# Altium schematic sheet Sheet1.SchDoc
size A3
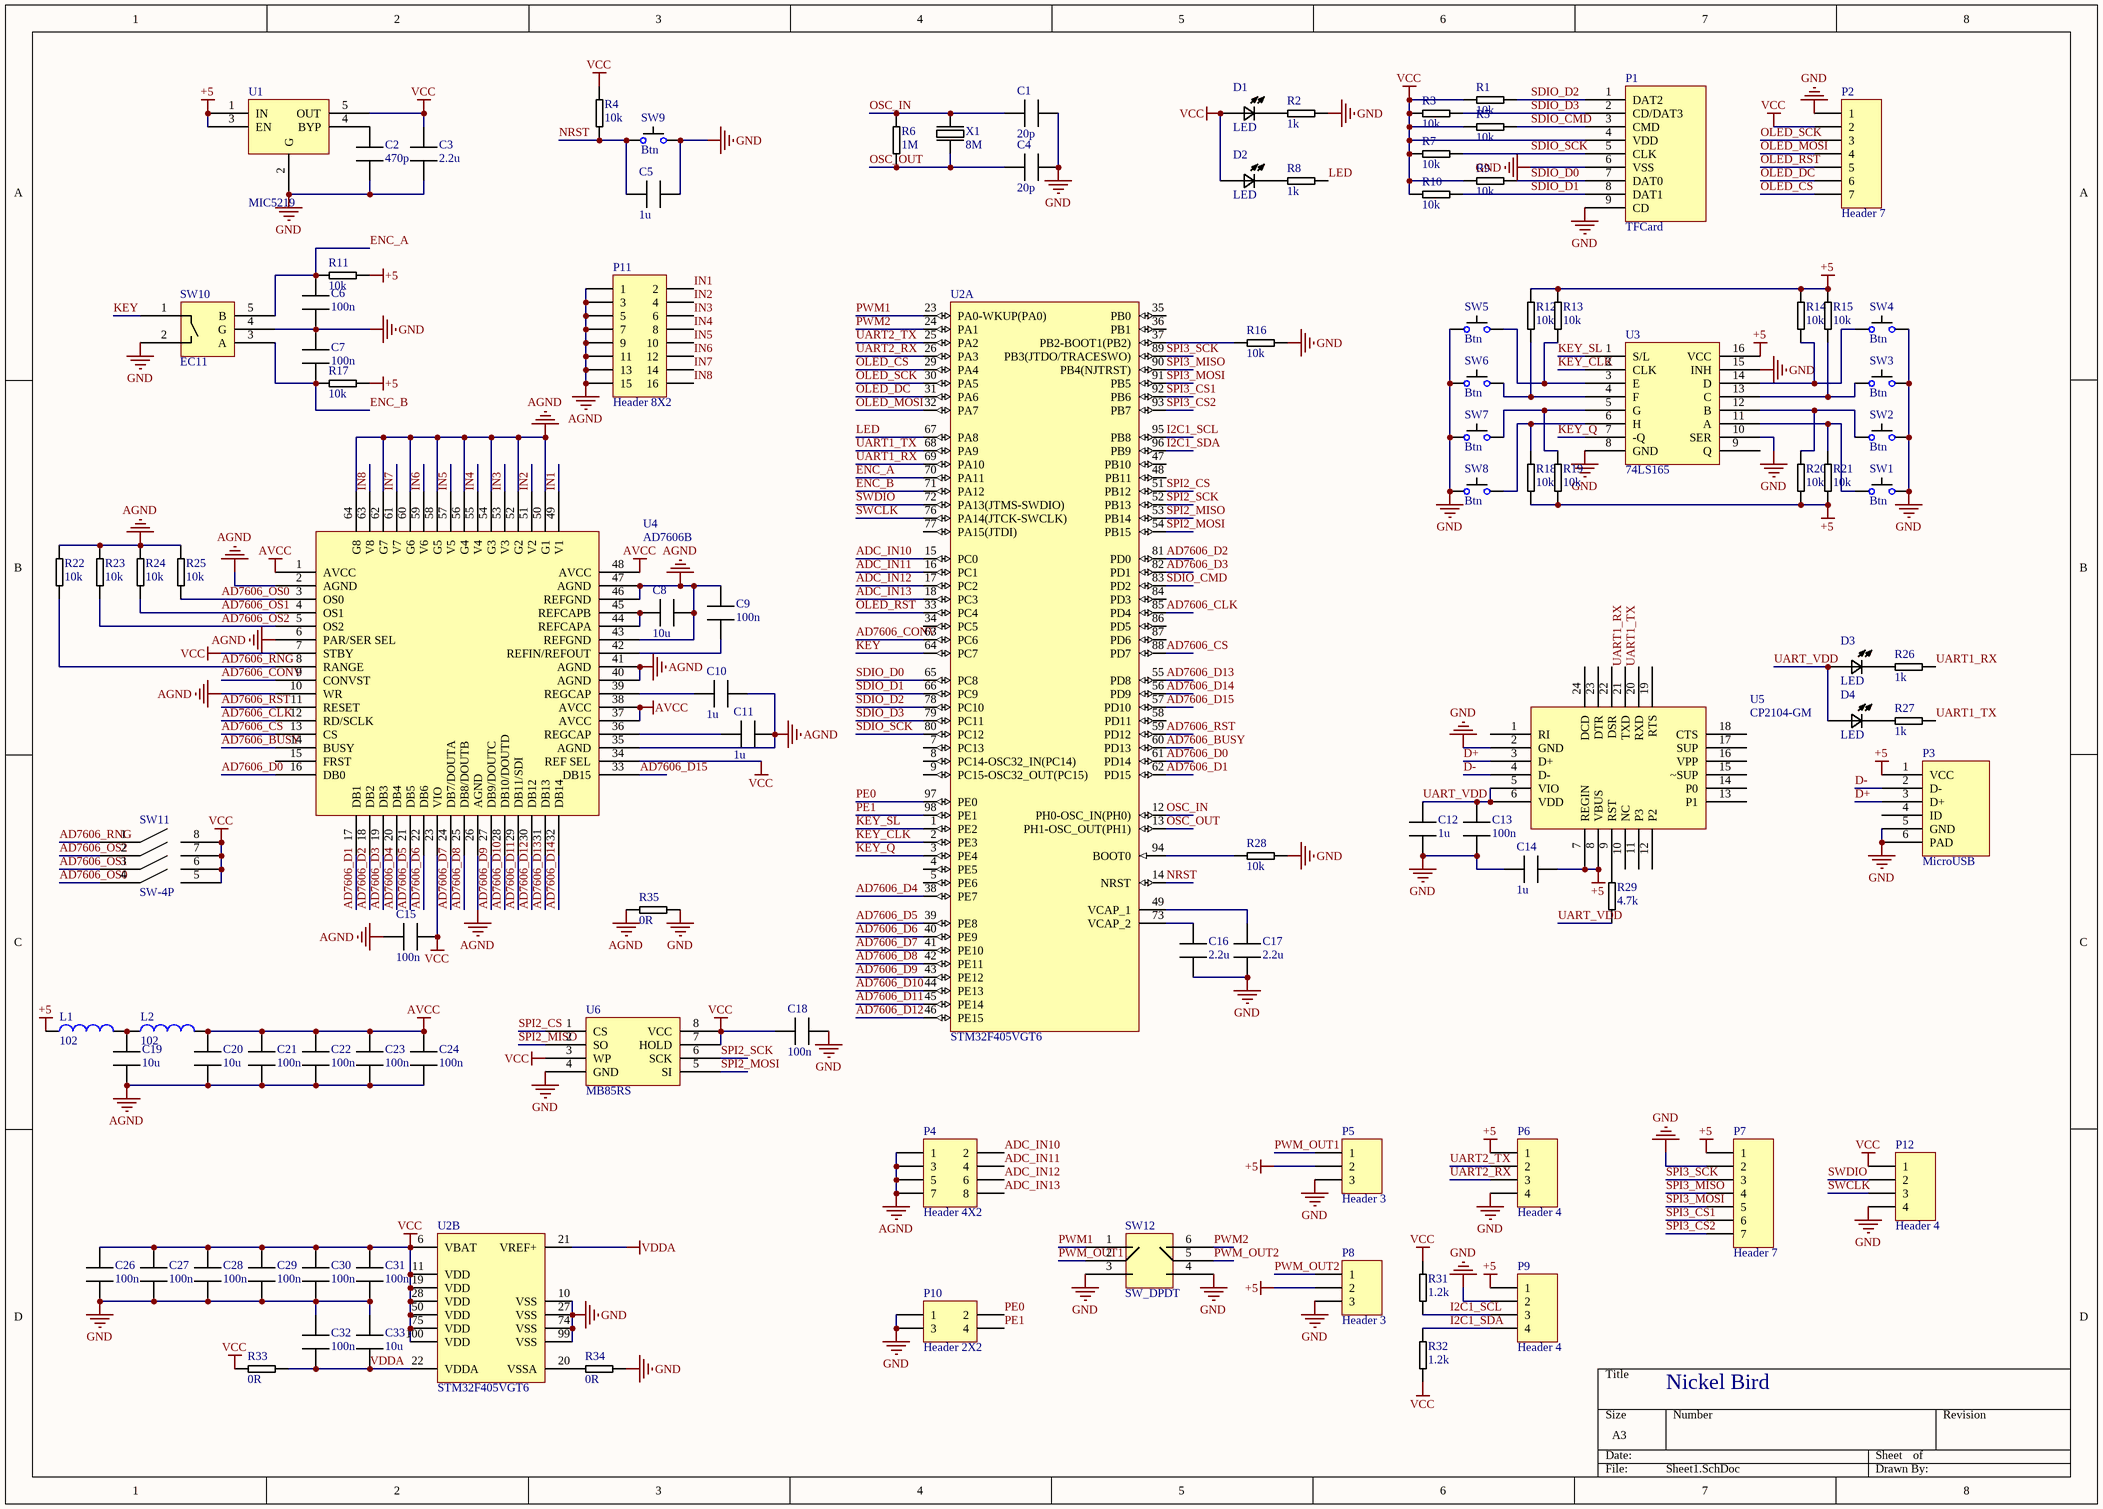
[diagram p0: Sheet1.SchDoc]

## Parts
C1  20p  [0603]
C2  470p  [0603]
C3  2.2u  [0603]
C4  20p  [0603]
C5  1u  [0603]
C6  100n  [0603]
C7  100n  [0603]
C8  10u  [0603]
C9  100n  [0603]
C10  1u  [0603]
C11  1u  [0603]
C12  1u  [0603]
C13  100n  [0603]
C14  1u  [0603]
C15  100n  [0603]
C16  2.2u  [0603]
C17  2.2u  [0603]
C18  100n  [0603]
C19  10u  [0603]
C20  10u  [0603]
C21  100n  [0603]
C22  100n  [0603]
C23  100n  [0603]
C24  100n  [0603]
C26  100n  [0603]
C27  100n  [0603]
C28  100n  [0603]
C29  100n  [0603]
C30  100n  [0603]
C31  100n  [0603]
C32  100n  [0603]
C33  10u  [0603]
D1  LED  [0603-1]
D2  LED  [0603-1]
D3  LED  [0603-1]
D4  LED  [0603-1]
L1  102  [0603]
L2  102  [0603]
P1  TFCard  [TF Card]
P2  Header 7  [HDR1X7]
P3  MicroUSB  [MicroUSB]
P4  Header 4X2  [HDR2X4]
P5  Header 3  [HDR1X3]
P6  Header 4  [HDR1X4]
P7  Header 7  [HDR1X7]
P8  Header 3  [HDR1X3]
P9  Header 4  [HDR1X4]
P10  Header 2X2  [HDR2X2]
P11  Header 8X2  [HDR2X8]
P12  Header 4  [HDR1X4]
R1  10k  [0603]
R2  1k  [0603]
R3  10k  [0603]
R4  10k  [0603]
R5  10k  [0603]
R6  1M  [0603]
R7  10k  [0603]
R8  1k  [0603]
R9  10k  [0603]
R10  10k  [0603]
R11  10k  [0603]
R12  10k  [0603]
R13  10k  [0603]
R14  10k  [0603]
R15  10k  [0603]
R16  10k  [0603]
R17  10k  [0603]
R18  10k  [0603]
R19  10k  [0603]
R20  10k  [0603]
R21  10k  [0603]
R22  10k  [0603]
R23  10k  [0603]
R24  10k  [0603]
R25  10k  [0603]
R26  1k  [0603]
R27  1k  [0603]
R28  10k  [0603]
R29  4.7k  [0603]
R31  1.2k  [0603]
R32  1.2k  [0603]
R33  0R  [0603]
R34  0R  [0603]
R35  0R  [0603]
SW1  Btn  [BTN3*3]
SW2  Btn  [BTN3*3]
SW3  Btn  [BTN3*3]
SW4  Btn  [BTN3*3]
SW5  Btn  [BTN3*3]
SW6  Btn  [BTN3*3]
SW7  Btn  [BTN3*3]
SW8  Btn  [BTN3*3]
SW9  Btn  [BTN3*3]
SW10  EC11  [EC11]
SW11  SW-4P  [SW-1.27-4P]
SW12  SW_DPDT  [DPDT7mm]
U1  MIC5219  [SOT23-5]
U2  STM32F405VGT6  [STM-LQFP100_N]  (parts A,B of 2)
U3  74LS165  [SOP16]
U4  AD7606B  [LQFP-64]
U5  CP2104-GM  [QFN-24-Pad]
U6  MB85RS  [SOP8]
X1  8M  [49SMD]

## Nets
+5: C14.2 L1.1 P3.1(VCC) P5.2 P6.1 P7.1 P8.2 P9.1 R11.2 R12.2 R13.2 R14.2 R15.2 R17.2 R18.1 R19.1 R20.1 R21.1 U1.1(IN) U1.3(EN) U3.16(VCC) U5.7(REGIN) U5.8(VBUS)
AGND: C8.2 C9.2 C10.2 C11.2 C15.1 C19.1 C20.1 C21.1 C22.1 C23.1 C24.1 P4.1 P4.3 P4.5 P4.7 P11.1 P11.3 P11.5 P11.7 P11.9 P11.11 P11.13 P11.15 R22.2 R23.2 R24.2 R25.2 R35.1 U4.2(AGND) U4.6(PAR/SER_SEL) U4.10(WR) U4.26(AGND) U4.35(AGND) U4.40(AGND) U4.41(AGND) U4.43(REFGND) U4.46(REFGND) U4.47(AGND) U4.50(G1) U4.52(G2) U4.54(G3) U4.56(G4) U4.58(G5) U4.60(G6) U4.62(G7) U4.64(G8)
AVCC: C20.2 C21.2 C22.2 C23.2 C24.2 L2.2 U4.1(AVCC) U4.37(AVCC) U4.38(AVCC) U4.48(AVCC)
GND: C1.2 C2.1 C3.1 C4.2 C5.2 C6.1 C7.2 C12.1 C13.1 C14.1 C16.1 C17.1 C18.2 C26.1 C27.1 C28.1 C29.1 C30.1 C31.1 C32.2 C33.2 P1.6(VSS) P1.9(CD) P2.1 P3.5(GND) P3.6(PAD) P5.3 P6.4 P7.2 P8.3 P9.2 P10.1 P10.3 P12.4 R2.2 R16.2 R28.2 R34.2 R35.2 SW1.2 SW2.2 SW3.2 SW4.2 SW5.1 SW6.1 SW7.1 SW8.1 SW9.2 SW10.2(A) SW10.4(G) SW12.3 SW12.4 U1.2(G) U2.10(VSS) U2.27(VSS) U2.74(VSS) U2.99(VSS) U3.8(GND) U3.10(SER) U3.15(INH) U5.2(GND) U6.4(GND)
VCC: C3.2 C15.2 C18.1 C26.2 C27.2 C28.2 C29.2 C30.2 C31.2 D1.1 D2.1 P1.4(VDD) P2.2 P12.1 R1.1 R3.1 R4.2 R5.1 R7.1 R9.1 R10.1 R31.2 R32.1 R33.1 SW11.5 SW11.6 SW11.7 SW11.8 U1.5(OUT) U2.6(VBAT) U2.11(VDD) U2.19(VDD) U2.28(VDD) U2.50(VDD) U2.75(VDD) U2.100(VDD) U4.7(STBY) U4.23(VIO) U4.34(REF_SEL) U6.3(WP) U6.7(HOLD) U6.8(VCC)
VDDA: C32.1 C33.1 R33.2 U2.21(VREF+) U2.22(VDDA)
AD7606_BUSY: U2.60(PD13) U4.14(BUSY)
AD7606_CLK: U2.85(PD4) U4.12(RD/SCLK)
AD7606_CONV: U2.63(PC6) U4.9(CONVST)
AD7606_CS: U2.88(PD7) U4.13(CS)
AD7606_D0: U2.61(PD14) U4.16(DB0)
AD7606_D1: U2.62(PD15) U4.17(DB1)
AD7606_D2: U2.81(PD0) U4.18(DB2)
AD7606_D3: U2.82(PD1) U4.19(DB3)
AD7606_D4: U2.38(PE7) U4.20(DB4)
AD7606_D5: U2.39(PE8) U4.21(DB5)
AD7606_D6: U2.40(PE9) U4.22(DB6)
AD7606_D7: U2.41(PE10) U4.24(DB7/DOUTA)
AD7606_D8: U2.42(PE11) U4.25(DB8/DOUTB)
AD7606_D9: U2.43(PE12) U4.27(DB9/DOUTC)
AD7606_D10: U2.44(PE13) U4.28(DB10/DOUTD)
AD7606_D11: U2.45(PE14) U4.29(DB11/SDI)
AD7606_D12: U2.46(PE15) U4.30(DB12)
AD7606_D13: U2.55(PD8) U4.31(DB13)
AD7606_D14: U2.56(PD9) U4.32(DB14)
AD7606_D15: U2.57(PD10) U4.33(DB15)
AD7606_OS0: R25.1 SW11.4 U4.3(OS0)
AD7606_OS1: R24.1 SW11.3 U4.4(OS1)
AD7606_OS2: R23.1 SW11.2 U4.5(OS2)
AD7606_RNG: R22.1 SW11.1 U4.8(RANGE)
AD7606_RST: U2.59(PD12) U4.11(RESET)
ADC_IN10: P4.2 U2.15(PC0)
ADC_IN11: P4.4 U2.16(PC1)
ADC_IN12: P4.6 U2.17(PC2)
ADC_IN13: P4.8 U2.18(PC3)
D+: P3.3(D+) U5.3(D+)
D-: P3.2(D-) U5.4(D-)
ENC_A: C6.2 R11.1 SW10.5(B) U2.70(PA11)
ENC_B: C7.1 R17.1 SW10.3(A) U2.71(PA12)
I2C1_SCL: P9.3 R31.1 U2.95(PB8)
I2C1_SDA: P9.4 R32.2 U2.96(PB9)
IN1: P11.2 U4.49(V1)
IN2: P11.4 U4.51(V2)
IN3: P11.6 U4.53(V3)
IN4: P11.8 U4.55(V4)
IN5: P11.10 U4.57(V5)
IN6: P11.12 U4.59(V6)
IN7: P11.14 U4.61(V7)
IN8: P11.16 U4.63(V8)
KEY: SW10.1(K) U2.64(PC7)
KEY_CLK: U2.2(PE3) U3.2(CLK)
KEY_Q: U2.3(PE4) U3.7(-Q)
KEY_SL: U2.1(PE2) U3.1(S/L)
LED: R8.2 U2.67(PA8)
NRST: C5.1 R4.1 SW9.1 U2.14(NRST)
OLED_CS: P2.7 U2.29(PA4)
OLED_DC: P2.6 U2.31(PA6)
OLED_MOSI: P2.4 U2.32(PA7)
OLED_RST: P2.5 U2.33(PC4)
OLED_SCK: P2.3 U2.30(PA5)
OSC_IN: C1.1 R6.2 U2.12(PH0-OSC_IN(PH0)) X1.2
OSC_OUT: C4.1 R6.1 U2.13(PH1-OSC_OUT(PH1)) X1.1
PE0: P10.2 U2.97(PE0)
PE1: P10.4 U2.98(PE1)
PWM1: SW12.1 U2.23(PA0-WKUP(PA0))
PWM2: SW12.6 U2.24(PA1)
PWM_OUT1: P5.1 SW12.2
PWM_OUT2: P8.1 SW12.5
SDIO_CMD: P1.3(CMD) R5.2 U2.83(PD2)
SDIO_D0: P1.7(DAT0) R9.2 U2.65(PC8)
SDIO_D1: P1.8(DAT1) R10.2 U2.66(PC9)
SDIO_D2: P1.1(DAT2) R1.2 U2.78(PC10)
SDIO_D3: P1.2(CD/DAT3) R3.2 U2.79(PC11)
SDIO_SCK: P1.5(CLK) R7.2 U2.80(PC12)
SPI2_CS: U2.51(PB12) U6.1(CS)
SPI2_MISO: U2.53(PB14) U6.2(SO)
SPI2_MOSI: U2.54(PB15) U6.5(SI)
SPI2_SCK: U2.52(PB13) U6.6(SCK)
SPI3_CS1: P7.6 U2.92(PB6)
SPI3_CS2: P7.7 U2.93(PB7)
SPI3_MISO: P7.4 U2.90(PB4(NJTRST))
SPI3_MOSI: P7.5 U2.91(PB5)
SPI3_SCK: P7.3 U2.89(PB3(JTDO/TRACESWO))
SWCLK: P12.3 U2.76(PA14(JTCK-SWCLK))
SWDIO: P12.2 U2.72(PA13(JTMS-SWDIO))
UART1_RX: R26.2 U2.69(PA10) U5.21(TXD)
UART1_TX: R27.2 U2.68(PA9) U5.20(RXD)
UART2_RX: P6.3 U2.26(PA3)
UART2_TX: P6.2 U2.25(PA2)
UART_VDD: C12.2 C13.2 D3.1 D4.1 R29.1 U5.5(VIO) U5.6(VDD)
NetC2_2: C2.2 U1.4(BYP)
NetC8_1: C8.1 U4.44(REFCAPA) U4.45(REFCAPB)
NetC9_1: C9.1 U4.42(REFIN/REFOUT)
NetC10_1: C10.1 U4.39(REGCAP)
NetC11_1: C11.1 U4.36(REGCAP)
NetC16_2: C16.2 U2.73(VCAP_2)
NetC17_2: C17.2 U2.49(VCAP_1)
NetC19_2: C19.2 L1.2 L2.1
NetD1_2: D1.2 R2.1
NetD2_2: D2.2 R8.1
NetD3_2: D3.2 R26.1
NetD4_2: D4.2 R27.1
NetR12_1: R12.1 SW6.2 U3.4(F)
NetR13_1: R13.1 SW5.2 U3.3(E)
NetR14_1: R14.1 SW4.1 U3.14(D)
NetR15_1: R15.1 SW3.1 U3.13(C)
NetR16_1: R16.1 U2.37(PB2-BOOT1(PB2))
NetR18_2: R18.2 SW8.2 U3.6(H)
NetR19_2: R19.2 SW7.2 U3.5(G)
NetR20_2: R20.2 SW2.1 U3.12(B)
NetR21_2: R21.2 SW1.1 U3.11(A)
NetR28_1: R28.1 U2.94(BOOT0)
NetR29_2: R29.2 U5.9(RST)
NetR34_1: R34.1 U2.20(VSSA)

Not connected (* = marked no-connect by the designer): P3 4(ID); U2 4(PE5) 5(PE6) 7(PC13) 8(PC14-OSC32_IN(PC14)) 9(PC15-OSC32_OUT(PC15)) 34(PC5) 35(PB0) 36(PB1) 47(PB10) 48(PB11) 58(PD11) 77(PA15(JTDI)) 84(PD3) 86(PD5) 87(PD6); U3 9(Q); U4 15(FRST); U5 1(RI) 10(NC) 11(P3) 12(P2) 13(P1) 14(P0) 15(~SUP) 16(VPP) 17(SUP) 18(CTS) 19(RTS) 22(DSR) 23(DTR) 24(DCD)

## Notes on the sheet
- Nickel Bird

## Library data of the parts
C1-C24 C26-C33 = Cap
L1 L2 = Inductor: BLM18RK102SN1D
P2 P7 = Header 7: Header, 7-Pin; LatestRevisionDate: 17-Jul-2002; LatestRevisionNote: Re-released for DXP Platform.; Publisher: Altium Limited
P4 = Header 4X2: Header, 4-Pin, Dual row; LatestRevisionDate: 17-Jul-2002; LatestRevisionNote: Re-released for DXP Platform.; Publisher: Altium Limited
P5 P8 = Header 3: Header, 3-Pin; LatestRevisionDate: 17-Jul-2002; LatestRevisionNote: Re-released for DXP Platform.; Publisher: Altium Limited
P6 P9 P12 = Header 4: Header, 4-Pin; LatestRevisionDate: 17-Jul-2002; LatestRevisionNote: Re-released for DXP Platform.; Publisher: Altium Limited
P10 = Header 2X2: Header, 2-Pin, Dual row; LatestRevisionDate: 17-Jul-2002; LatestRevisionNote: Re-released for DXP Platform.; Publisher: Altium Limited
P11 = Header 8X2: Header, 8-Pin, Dual row; LatestRevisionDate: 17-Jul-2002; LatestRevisionNote: Re-released for DXP Platform.; Publisher: Altium Limited
R1-R29 R31-R35 = Res
U2 = STM32F405VGT6: ARM Cortex-M4 32-bit MCU+FPU, 210 DMIPS, 1024 kB Flash, 192 kB Internal RAM, 82 I/Os, 100-pin LQFP, -40 to 85 degC, Tray; Manufacturer: STMicroelectronics; D/A Converter: 2x12-bit; FLASH Size (Prog) (kB): 1024; I/Os (High Current): 82; Internal RAM Size (kB): 192; Operating Frequency(F) (Processor speed) (MHz): 168; Supply Voltage(Vcc) max (V): 3.6; Supply Voltage(Vcc) min (V): 1.8; DatasheetVersion: Rev. 4; PackageVersion: Rev. 1, 06/2013; PackageReference: LQFP100; PackageDescription: 100-Pin Low Profile Quad Flat Package, 14 x 14 mm Body, 0.5 mm Pitch; Supplier 1: Digi-Key; Supplier Part Number 1: 497-11910-ND; Supplier 2: Farnell; Supplier Part Number 2: 2215224; Supplier 3: Newark; Supplier Part Number 3: 46W2199; Supplier 4: Newark; Supplier Part Number 4: 94T6493; Supplier 5: Mouser; Supplier Part Number 5: 511-STM32F405VGT6; Core: ARM Cortex-M4; Packing: Tray; Mounting Technology: Surface Mount; PartNumber: STM32F405VGT6; ComponentLink1Description: Manufacturer URL; ComponentLink1URL: http://www.st.com/web/en/home.html; ComponentLink2Description: Datasheet; ComponentLink2URL: http://www.st.com/st-web-ui/static/active/en/resource/technical/document/datasheet/DM00037051.pdf; ComponentLink3Description: Package Specification; ComponentLink3URL: http://www.st.com/st-web-ui/static/active/en/resource/technical/document/data_brief/DM00071938.pdf
X1 = XTAL